# Altium schematic sheet V_5.SchDoc
size A4
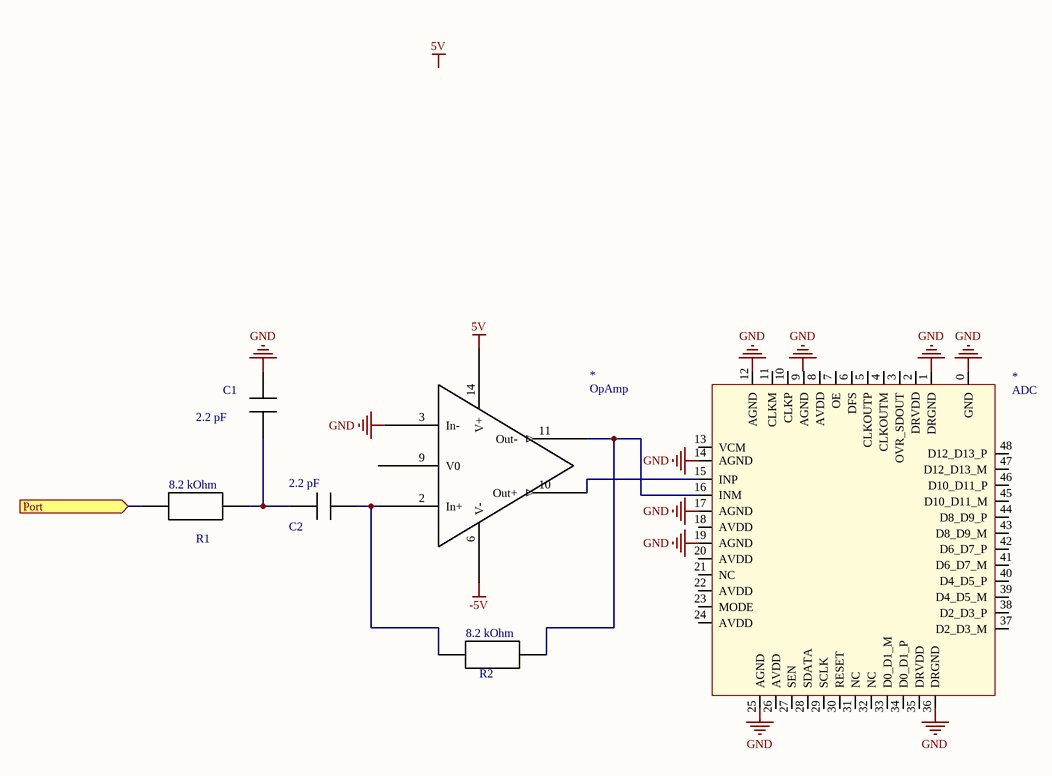
[diagram p0: V_5.SchDoc]

## Parts
(Parts that share a designator on the sheet are numbered #1, #2 ... from top to bottom, then left to right.)
2.2_pF#1  C1
2.2_pF#2  C2
8.2_kOhm#1  R1
8.2_kOhm#2  R2
*#1  ADC
*#2  OpAmp

## Ports
Port (in)

## Nets
5V: *#2.14(V+)
-5V: *#2.6(V-)
GND: *#1.0(GND) *#1.1(DRGND) *#1.12(AGND) *#1.14(AGND) *#1.17(AGND) *#1.19(AGND) *#1.25(AGND) *#1.36(DRGND)
Net*#1_15: *#1.15(INP) *#2.10(Out+)
Net*#1_16: *#1.16(INM) *#2.11(Out-)

Not connected (* = marked no-connect by the designer): *#1 2(DRVDD) 3(OVR_SDOUT) 4(CLKOUTM) 5(CLKOUTP) 6(DFS) 7(OE) 8(AVDD) 9(AGND) 10(CLKP) 11(CLKM) 13(VCM) 18(AVDD) 20(AVDD) 21(NC) 22(AVDD) 23(MODE) 24(AVDD) 26(AVDD) 27(SEN) 28(SDATA) 29(SCLK) 30(RESET) 31(NC) 32(NC) 33(D0_D1_M) 34(D0_D1_P) 35(DRVDD) 37(D2_D3_M) 38(D2_D3_P) 39(D4_D5_M) 40(D4_D5_P) 41(D6_D7_M) 42(D6_D7_P) 43(D8_D9_M) 44(D8_D9_P) 45(D10_D11_M) 46(D10_D11_P) 47(D12_D13_M) 48(D12_D13_P); *#2 2(In+) 3(In-) 9(V0)

## Notes on the sheet
- Labels drawn without touching a wire or pin: 5V, GND

## Library data of the parts
2.2_pF#1 2.2_pF#2 = C
8.2_kOhm#1 8.2_kOhm#2 = R